# Altium schematic sheet POWER.SchDoc
size A4
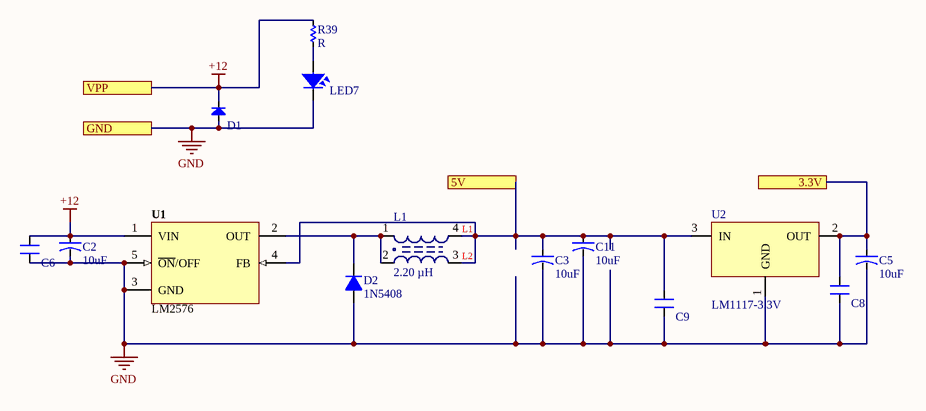
[diagram p0: POWER.SchDoc]

## Parts
C2  10uF  [CAP-ALU-SMD-6.3x7.7x2.2]
C3  10uF  [CAP-ALU-SMD-6.3x7.7x2.2]
C5  10uF  [CAP-ALU-SMD-6.3x7.7x2.2]
C6  CN  [CN-SMD-0603_big]  (value not drawn)
C8  CN  [CN-SMD-0603_big]  (value not drawn)
C9  CN  [CN-SMD-0603_big]  (value not drawn)
C11  10uF  [CAP-ALU-SMD-6.3x7.7x2.2]
D1  Diode  [DIO-SMD-214AC]  (value not drawn)
D2  1N5408  [D5AN]
L1  2.20 µH  [L-SMD-D-12.5x12.5]
LED7  LED  [LED-0805-Blue]  (value not drawn)
R39  R  [RES-SMD-0603_BIG]
U1  LM2576  [TO263]
U2  LM1117-3.3V  [SOT223]

## Ports
3.3V, 5V, GND, VPP

## Nets
+12: C2.1 C6.2 D1.2(K) R39.1 U1.1(VIN) ; port VPP
GND: C2.2 C3.2 C5.2 C6.1 C8.1 C9.1 C11.2 D1.1(A) D2.1(A) LED7.2 U1.3(GND) U1.5(~{ON}/OFF) U2.1(GND) ; port GND
3.3V: C5.1 C8.2 U2.2(OUT) ; port 3.3V
5V: C3.1 C9.2 C11.1 L1.3 L1.4 U1.4(FB) U2.3(IN) ; port 5V
NetD2_2: D2.2(K) L1.1 L1.2 U1.2(OUT)
NetLED7_1: LED7.1 R39.2

## Notes on the sheet
- (in symbol L-SMD-2) L2

## Library data of the parts
C2 C3 C5 C11 = CN-ALU-SMD: Polarized Capacitor (Axial); Published: 8-Jun-2000; LatestRevisionDate: 17-Jul-2002; LatestRevisionNote: Re-released for DXP Platform.; PackageReference: POLAR0.8; Publisher: Altium Limited
C6 C8 C9 = CN: Value: 33pF
D1 = Diode: Default Diode; Code - JEDEC: DO-214-AB; Value: 1N5007; Published: 8-Jun-2000; Revision: July-2002: Re-released for DXP Platform.; Publisher: Altium Limited; ComponentLink1Description: ES1J - STMBL; ComponentLink1URL: https://banlinhkien.vn/goods-8089-es1j-do214-diode-1a-600v-sma-es1j-.html
D2 = D5A: Diode 5A; Value: 1N5408
L1 = L-SMD-2: partNo: 7448709022; Manufacturer: Würth Elektronik eiSos GmbH; Inductance: 2.20 µH; ComponentLink1Description: Manufacturer; ComponentLink1URL: http://www.we-online.de; Created by: Christin Otto; Created Date: August 2013; ComponentLink2Description: Datasheet; ComponentLink2URL: http://katalog.we-online.de/pbs/datasheet/7448709022.pdf; ComponentLink3Description: THEGIOIIC; ComponentLink3URL: https://www.thegioiic.com/products/cuon-cam-33uh-rh127-smd-12x12x7
LED7 = LED SMD: Value: LED 3 - 5 ly 2 Colour
U1 = LM2576: Max Input Voltage: 12 V; Max Output Current: 3 (6.0 peak) A; Max Output Voltage: mV; Category: IC-Power; Min Input Voltage: mV; Min Output Voltage: mV; Mounting Technology: Surface Mount; Status: Unreleased; Supply Voltage: mV; Temperature Range: -40 to +125 degC; ComponentLink1Description: MUA; ComponentLink1URL: https://www.thegioiic.com/products/lm2596s-5-0
U2 = LM1117: 800mA Low-Dropout Linear Regulator; Creator: Nguyen Ba Bien; Website: http://group3i.net